# EAGLE schematic tjt_elec_v14 (EAGLE 9.7.0)
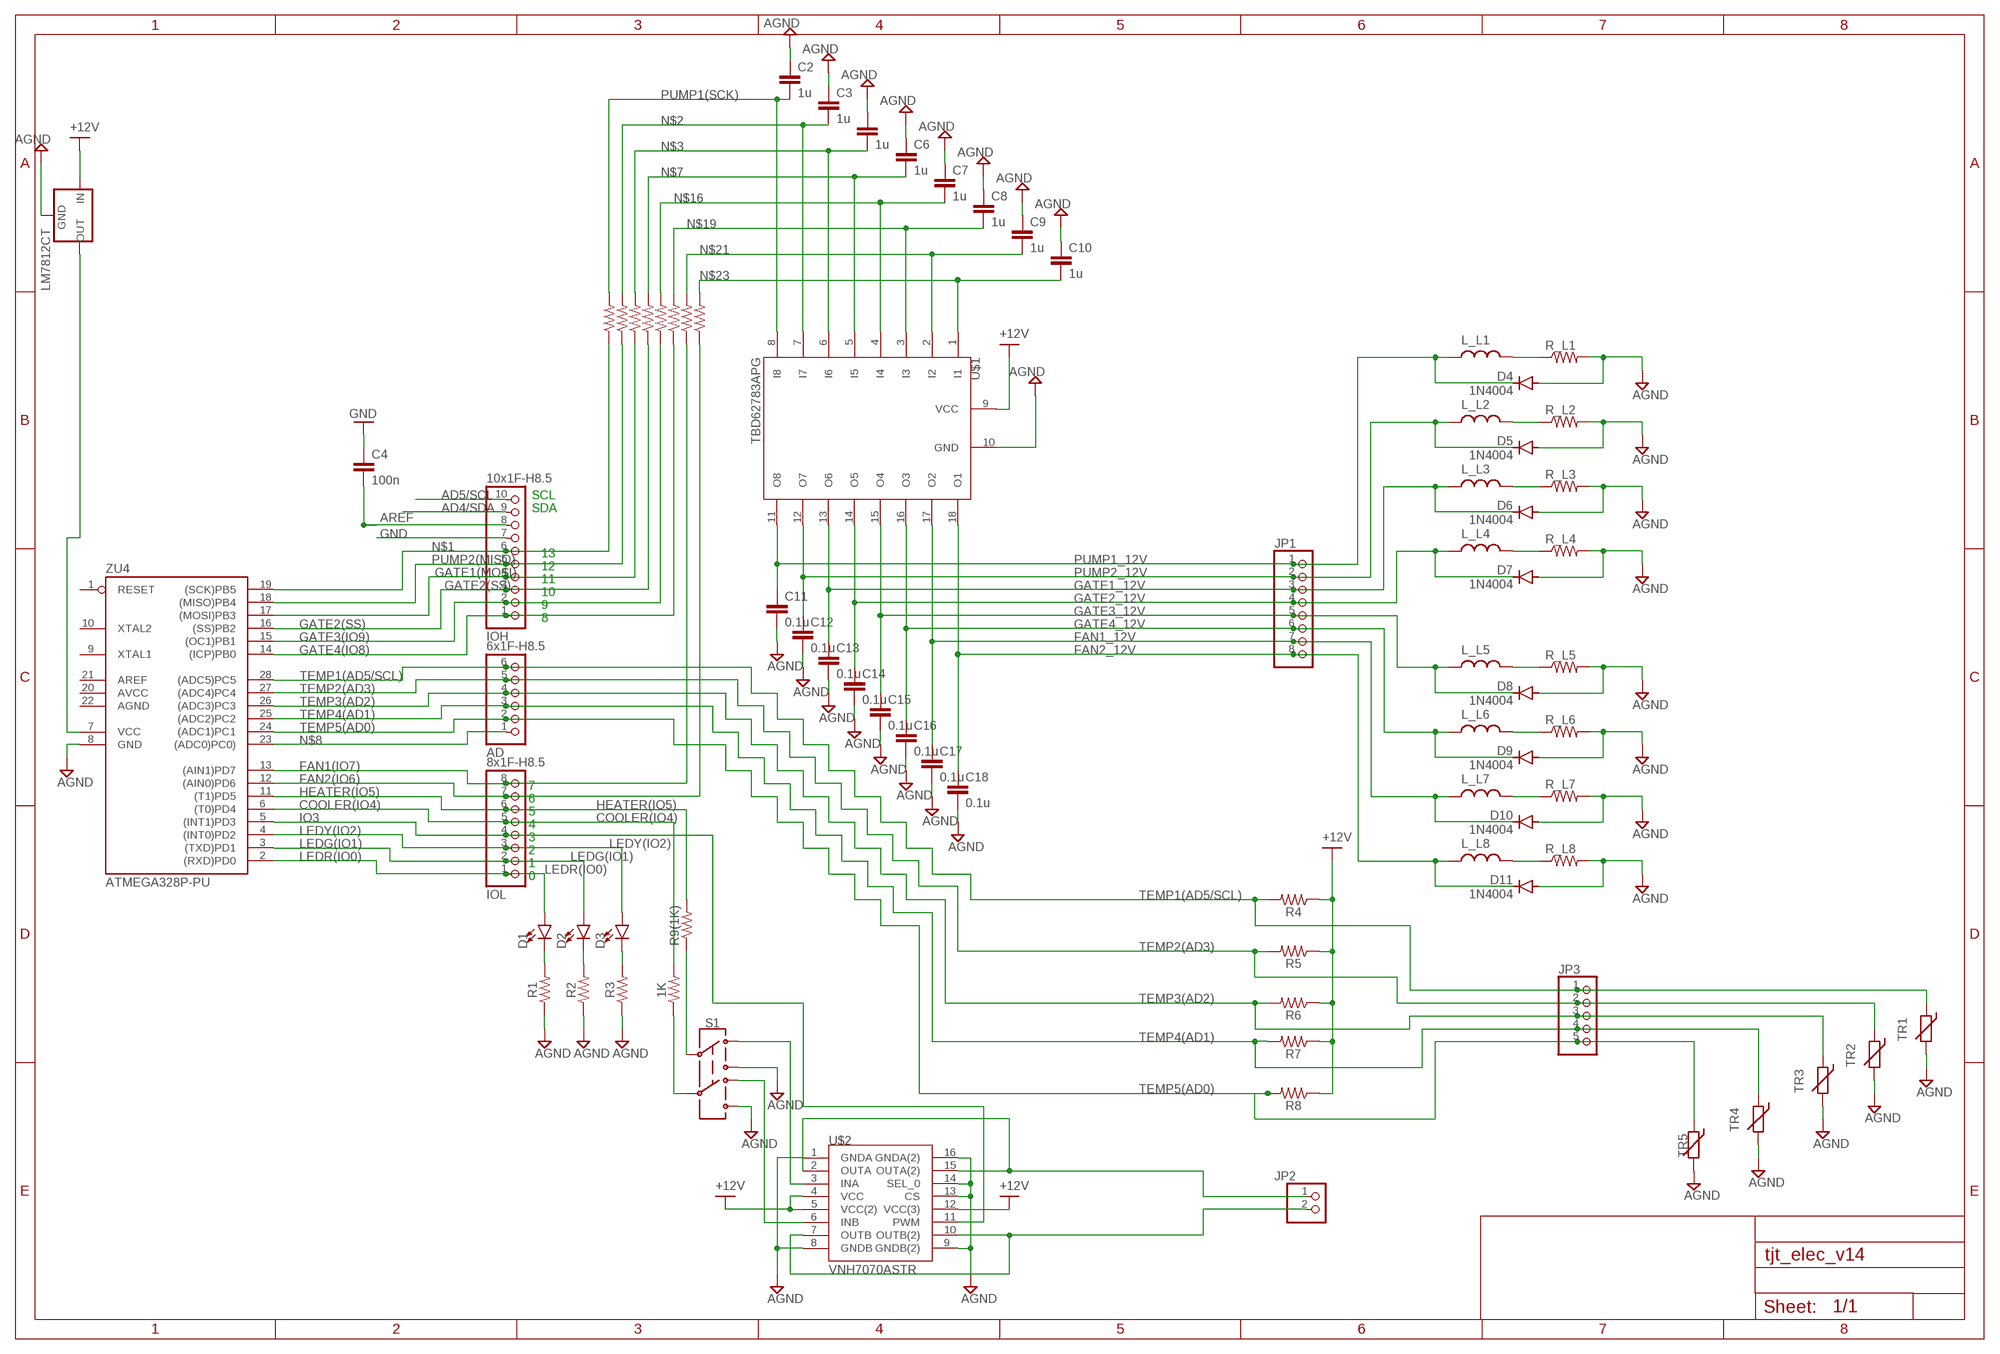
[diagram p0: schematic, sheet 1]

## Parts
1K  RESISTORAXIAL-0.3  [AXIAL-0.3]
AD  6x1F-H8.5  PINHD-1X6  [1X06]
C2  1u  C-EU0603-RND  [C0603-ROUND]
C3  1u  C-EU0603-RND  [C0603-ROUND]
C4  100n  C-EU0603-RND  [C0603-ROUND]
C5  1u  C-EU0603-RND  [C0603-ROUND]
C6  1u  C-EU0603-RND  [C0603-ROUND]
C7  1u  C-EU0603-RND  [C0603-ROUND]
C8  1u  C-EU0603-RND  [C0603-ROUND]
C9  1u  C-EU0603-RND  [C0603-ROUND]
C10  1u  C-EU0603-RND  [C0603-ROUND]
C11  0.1u  C-EU0603-RND  [C0603-ROUND]
C12  0.1u  C-EU0603-RND  [C0603-ROUND]
C13  0.1u  C-EU0603-RND  [C0603-ROUND]
C14  0.1u  C-EU0603-RND  [C0603-ROUND]
C15  0.1u  C-EU0603-RND  [C0603-ROUND]
C16  0.1u  C-EU0603-RND  [C0603-ROUND]
C17  0.1u  C-EU0603-RND  [C0603-ROUND]
C18  0.1u  C-EU0603-RND  [C0603-ROUND]
D1  LED5MM  [LED_5MM]
D2  LED5MM  [LED_5MM]
D3  LED5MM  [LED_5MM]
D4  1N4004  [DO41-10]
D5  1N4004  [DO41-10]
D6  1N4004  [DO41-10]
D7  1N4004  [DO41-10]
D8  1N4004  [DO41-10]
D9  1N4004  [DO41-10]
D10  1N4004  [DO41-10]
D11  1N4004  [DO41-10]
IOH  10x1F-H8.5  PINHD-1X10_ARD  [1X10]
IOL  8x1F-H8.5  PINHD-1X8  [1X08]
JP1  PINHD-1X8  [1X08]
JP2  PINHD-1X2  [1X02]
JP3  PINHD-1X5  [1X05]
L_L1  L_RADIAL-26MM-DIA  [INDRD2743W50D3810H2616B]
L_L2  L_RADIAL-26MM-DIA  [INDRD2743W50D3810H2616B]
L_L3  L_RADIAL-26MM-DIA  [INDRD2743W50D3810H2616B]
L_L4  L_RADIAL-26MM-DIA  [INDRD2743W50D3810H2616B]
L_L5  L_RADIAL-26MM-DIA  [INDRD2743W50D3810H2616B]
L_L6  L_RADIAL-26MM-DIA  [INDRD2743W50D3810H2616B]
L_L7  L_RADIAL-26MM-DIA  [INDRD2743W50D3810H2616B]
L_L8  L_RADIAL-26MM-DIA  [INDRD2743W50D3810H2616B]
LM7812CT  78XXL  [78XXL]
R1  RESISTORAXIAL-0.3  [AXIAL-0.3]
R2  RESISTORAXIAL-0.3  [AXIAL-0.3]
R3  RESISTORAXIAL-0.3  [AXIAL-0.3]
R4  RESISTORAXIAL-0.3  [AXIAL-0.3]
R5  RESISTORAXIAL-0.3  [AXIAL-0.3]
R6  RESISTORAXIAL-0.3  [AXIAL-0.3]
R7  RESISTORAXIAL-0.3  [AXIAL-0.3]
R8  RESISTORAXIAL-0.3  [AXIAL-0.3]
R9  1k  1KOHM-HORIZ-1/4W-1%  [AXIAL-0.3]
R9(1K)  RESISTORAXIAL-0.3  [AXIAL-0.3]
R10  1k  1KOHM-HORIZ-1/4W-1%  [AXIAL-0.3]
R11  1k  1KOHM-HORIZ-1/4W-1%  [AXIAL-0.3]
R12  1k  1KOHM-HORIZ-1/4W-1%  [AXIAL-0.3]
R13  1k  1KOHM-HORIZ-1/4W-1%  [AXIAL-0.3]
R14  1k  1KOHM-HORIZ-1/4W-1%  [AXIAL-0.3]
R15  1k  1KOHM-HORIZ-1/4W-1%  [AXIAL-0.3]
R16  1k  1KOHM-HORIZ-1/4W-1%  [AXIAL-0.3]
R_L1  R-US_AXIAL-7.2MM-PITCH  [RESAD724W46L381D178B]
R_L2  R-US_AXIAL-7.2MM-PITCH  [RESAD724W46L381D178B]
R_L3  R-US_AXIAL-7.2MM-PITCH  [RESAD724W46L381D178B]
R_L4  R-US_AXIAL-7.2MM-PITCH  [RESAD724W46L381D178B]
R_L5  R-US_AXIAL-7.2MM-PITCH  [RESAD724W46L381D178B]
R_L6  R-US_AXIAL-7.2MM-PITCH  [RESAD724W46L381D178B]
R_L7  R-US_AXIAL-7.2MM-PITCH  [RESAD724W46L381D178B]
R_L8  R-US_AXIAL-7.2MM-PITCH  [RESAD724W46L381D178B]
S1  SWITCH-DPDT-PTH-GPI-152-3013  [SWITCH_DPDT_PTH_GPI-152-3013]
TR1  THERMISTOR_R-7,5  [R-7,5]
TR2  THERMISTOR_R-7,5  [R-7,5]
TR3  THERMISTOR_R-7,5  [R-7,5]
TR4  THERMISTOR_R-7,5  [R-7,5]
TR5  THERMISTOR_R-7,5  [R-7,5]
U$1  TBD62783APG  [DIP762W53P254L1969H508Q18B]
U$2  VNH7070ASTR  [SOIC127P1032X265-16N]
ZU4  ATMEGA328P-PU  [DIL28-3]

## Nets
+V: LM7812CT.IN R4.P$1 R5.P$1 R6.P$1 R7.P$1 R8.P$1 U$1.9(VCC) U$2.4(VCC) U$2.5(VCC(2)) U$2.12(VCC(3)) ; supply symbol labelled +12V
AD4/SDA: IOH.9
AD5/SCL: IOH.10
AREF [aref]: C4.2 IOH.8
COOLER(IO4): 1K.P$2 IOL.5 ZU4.6((T0)PD4)
FAN1(IO7): IOL.8 R15.P$1 ZU4.13((AIN1)PD7)
FAN1_12V: C17.1 D10.C JP1.7 L_L7.1 U$1.17(O2)
FAN2(IO6): IOL.7 R16.P$1 ZU4.12((AIN0)PD6)
FAN2_12V: C18.1 D11.C JP1.8 L_L8.1 U$1.18(O1)
GATE1(MOSI): IOH.4 R11.P$1 ZU4.17((MOSI)PB3)
GATE1_12V: C13.1 D6.C JP1.3 L_L3.1 U$1.13(O6)
GATE2(SS): IOH.3 R12.P$1 ZU4.16((SS)PB2)
GATE2_12V: C14.1 D7.C JP1.4 L_L4.1 U$1.14(O5)
GATE3(IO9): IOH.2 R13.P$1 ZU4.15((OC1)PB1)
GATE3_12V: C15.1 D8.C JP1.5 L_L5.1 U$1.15(O4)
GATE4(IO8): IOH.1 R14.P$1 ZU4.14((ICP)PB0)
GATE4_12V: C16.1 D9.C JP1.6 L_L6.1 U$1.16(O3)
GND [gnd]: C2.1 C3.1 C4.1 C5.1 C6.1 C7.1 C8.1 C9.1 C10.1 C11.2 C12.2 C13.2 C14.2 C15.2 C16.2 C17.2 C18.2 D4.A D5.A D6.A D7.A D8.A D9.A D10.A D11.A IOH.7 LM7812CT.GND R1.P$1 R2.P$1 R3.P$1 R_L1.2 R_L2.2 R_L3.2 R_L4.2 R_L5.2 R_L6.2 R_L7.2 R_L8.2 S1.20 S1.21 TR1.2 TR2.2 TR3.2 TR4.2 TR5.2 U$1.10(GND) U$2.1(GNDA) U$2.8(GNDB) U$2.9(GNDB(2)) U$2.13(CS) U$2.14(SEL_0) U$2.16(GNDA(2)) ZU4.8(GND) ; supply symbol labelled AGND
HEATER(IO5): IOL.6 R9(1K).P$2 ZU4.11((T1)PD5)
IO3: IOL.4 ZU4.5((INT1)PD3)
LEDG(IO1): D2.A IOL.2 ZU4.3((TXD)PD1)
LEDR(IO0): D1.A IOL.1 ZU4.2((RXD)PD0)
LEDY(IO2): D3.A IOL.3 ZU4.4((INT0)PD2)
N$1: IOH.6 R9.P$1 ZU4.19((SCK)PB5)
N$2: C3.2 R10.P$2 U$1.7(I7)
N$3: C5.2 R11.P$2 U$1.6(I6)
N$4: D1.K(C) R1.P$2
N$5: D2.K(C) R2.P$2
N$6: D3.K(C) R3.P$2
N$7: C6.2 R12.P$2 U$1.5(I5)
N$8: AD.1 ZU4.23((ADC0)PC0))
N$9: R9(1K).P$1 S1.C@1
N$10: 1K.P$1 S1.C@2
N$11: S1.10 U$2.3(INA)
N$12: JP2.1 U$2.2(OUTA) U$2.15(OUTA(2))
N$13: S1.11 U$2.6(INB)
N$14: JP2.2 U$2.7(OUTB) U$2.10(OUTB(2))
N$15: U$2.11(PWM)
N$16: C7.2 R13.P$2 U$1.4(I4)
N$17: L_L1.2 R_L1.1
N$18: L_L2.2 R_L2.1
N$19: C8.2 R14.P$2 U$1.3(I3)
N$20: L_L3.2 R_L3.1
N$21: C9.2 R15.P$2 U$1.2(I2)
N$22: L_L4.2 R_L4.1
N$23: C10.2 R16.P$2 U$1.1(I1)
N$24: L_L5.2 R_L5.1
N$25: LM7812CT.OUT ZU4.7(VCC)
N$27: L_L6.2 R_L6.1
N$29: L_L7.2 R_L7.1
N$31: L_L8.2 R_L8.1
PUMP1(SCK): C2.2 R9.P$2 U$1.8(I8)
PUMP1_12V: C11.1 D4.C JP1.1 L_L1.1 U$1.11(O8)
PUMP2(MISO): IOH.5 R10.P$1 ZU4.18((MISO)PB4)
PUMP2_12V: C12.1 D5.C JP1.2 L_L2.1 U$1.12(O7)
TEMP1(AD5/SCL): AD.6 JP3.1 R4.P$2 TR1.1 ZU4.28((ADC5)PC5)
TEMP2(AD3): AD.5 JP3.2 R5.P$2 TR2.1 ZU4.27((ADC4)PC4)
TEMP3(AD2): AD.4 JP3.3 R6.P$2 TR3.1 ZU4.26((ADC3)PC3)
TEMP4(AD1): AD.3 JP3.4 R7.P$2 TR4.1 ZU4.25((ADC2)PC2)
TEMP5(AD0): AD.2 JP3.5 R8.P$2 TR5.1 ZU4.24((ADC1)PC1)
Unconnected: ZU4.1(RESET) ZU4.9(XTAL1) ZU4.10(XTAL2) ZU4.21(AREF)

## Notes on the sheet
- SCL
- SDA
- 13
- 12
- 11
- 10
- 9
- 8
- 7
- 6
- 5
- 4
- 3
- 2
- 1
- 0

## Power pins joined to a net without a drawn wire
AGND: ZU4.22(AGND)
AVCC: ZU4.20(AVCC)

## Library data of the parts
1K R1-R8 R9(1K) = SparkFun-Resistors:RESISTOR: Generic Resistor Package
AD = SmartPrj:PINHD-1X6: PIN HEADER
C2-C18 = SmartPrj:C-EU: CAPACITOR, European symbol
D1-D3 = SparkFun-LED:LED: LED (Generic) Standard schematic elements and footprints for 5mm, 3mm, 1206, and 0603 sized LEDs. Generic LEDs with no color specified.
D4-D11 = diode:1N4004: DIODE general purpose rectifier, 1 A
IOH = SmartPrj:PINHD-1X10_ARD: PIN HEADER
IOL = SmartPrj:PINHD-1X8: PIN HEADER
JP1 = Connector:PINHD-1X8: PIN HEADER; CATEGORY: CONNECTOR; SUB-CATEGORY: PIN-HEADER
JP2 = Connector:PINHD-1X2: PIN HEADER; CATEGORY: CONNECTOR; SUB-CATEGORY: PIN-HEADER
JP3 = Connector:PINHD-1X5: PIN HEADER; CATEGORY: CONNECTOR; SUB-CATEGORY: PIN-HEADER
L_L1-L_L8 = Inductor:L: Inductor Fixed - Generic; CATEGORY: Inductor; SUB-CATEGORY: Fixed
LM7812CT = v-reg:78XXL: VOLTAGE REGULATOR
R9-R16 = SparkFun-Resistors:1KOHM: 1kΩ resistor A resistor is a passive two-terminal electrical component that implements electrical resistance as a circuit element. Resistors act to reduce current flow, and, at the same time, act to lower voltage levels within circuits. - Wikipedia; PROD_ID: RES-12182
R_L1-R_L8 = Resistor:R-US: Resistor Fixed - ANSI; CATEGORY: Resistor; SUB-CATEGORY: Fixed
S1 = SparkFun-Switches:SWITCH-DPDT: Double-Pole, Double-Throw (DPDT) Switch Double-pole, double-throw switches. Variant Overview PTH-GPI-152-3013 Used on SparkFun Geiger Counter <https://www.sparkfun.com/products/11345> SMD-AY0202 Surface Mount DPDT Switch <https://www.sparkfun.com/products/597> (COM-00597) Used on e.g. LilyPad Arduino USB - ATmega32U4 Board <https://www.sparkfun.com/products/12049>; PROD_ID: SWCH-10554
TR1-TR5 = discrete:THERMISTOR_: Thermo Resistor
U$1 = my_library:TBD62783APG
U$2 = my_library:VNH7070ASTR
ZU4 = SmartPrj:ATMEGA328P-: MICROCONTROLLER 4 Kbytes FLASH 128 bytes SRAM 256 bytes EEPROM UART 6-channel 10 bit ADC

## Net classes
0 default: width 0.254 mm, clearance 0.254 mm
1 power: width 0.61 mm, drill 0.61 mm, clearance 0.254 mm
2 gnd: width 0.305 mm, drill 0.559 mm, clearance 0.254 mm
3 usbvcc: width 0.508 mm, drill 0.61 mm, clearance 0.254 mm
4 aref: width 0.406 mm, drill 0.61 mm, clearance 0.254 mm